# Altium schematic sheet [3]-MCU.SchDoc
size A4
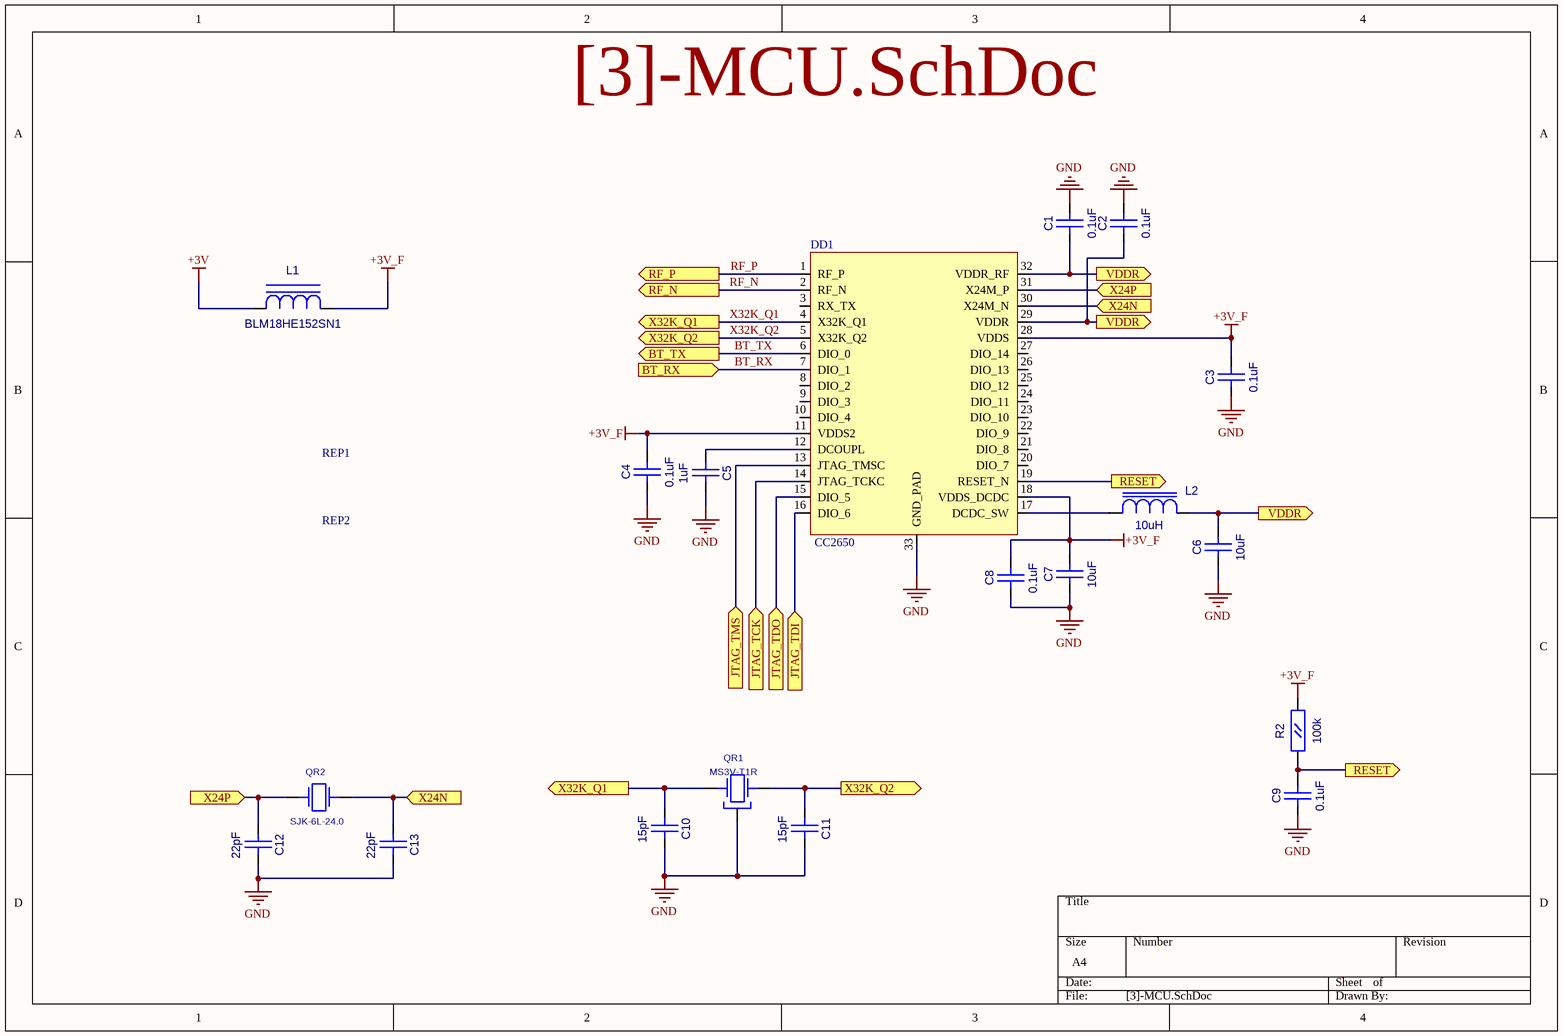
[diagram p0: [3]-MCU.SchDoc]

## Parts
C1  0.1uF  [CC0603]
C2  0.1uF  [CC0603]
C3  0.1uF  [CC0603]
C4  0.1uF  [CC0603]
C5  1uF  [CC0603]
C6  10uF  [CC0805]
C7  10uF  [CC0805]
C8  0.1uF  [CC0603]
C9  0.1uF  [CC0603]
C10  15pF  [CC0603]
C11  15pF  [CC0603]
C12  22pF  [CC0603]
C13  22pF  [CC0603]
DD1  CC2650  [QFN32_TI]
L1  BLM18HE152SN1  [L0603]
L2  10uH  [RC0805]
QR1  MS3V-T1R  [MS3V-T1R]
QR2  SJK-6L-24.0  [AC5032_2]
R2  100k  [RC0603]
REP1  REPER_POINT_1.2  [REPER1.2]  (value not drawn)
REP2  REPER_POINT_1.2  [REPER1.2]  (value not drawn)

## Ports
BT_RX (in), BT_TX (out), JTAG_TCK (in), JTAG_TDI (in), JTAG_TDO (in), JTAG_TMS (in), RESET (out), RF_N (out), RF_P (out), VDDR (out), X24N (in), X24P (in), X32K_Q1 (out), X32K_Q2 (out)

## Nets
+3V: L1.1(A)
+3V_F: C3.2(B) C4.2(B) C7.2(B) C8.2(B) DD1.11(VDDS2) DD1.18(VDDS_DCDC) DD1.28(VDDS) L1.2(C) R2.2(B)
GND: C1.2(B) C2.2(B) C3.1(A) C4.1(A) C5.2(B) C6.1(A) C7.1(A) C8.1(A) C9.1(A) C10.2(B) C11.2(B) C12.2(B) C13.2(B) DD1.33(GND_PAD) QR1.3
BT_RX: DD1.7(DIO_1) ; port BT_RX
BT_TX: DD1.6(DIO_0) ; port BT_TX
JTAG_TCK: DD1.14(JTAG_TCKC) ; port JTAG_TCK
JTAG_TDI: DD1.16(DIO_6) ; port JTAG_TDI
JTAG_TDO: DD1.15(DIO_5) ; port JTAG_TDO
JTAG_TMS: DD1.13(JTAG_TMSC) ; port JTAG_TMS
RESET: C9.2(B) DD1.19(RESET_N) R2.1(A) ; port RESET
RF_N: DD1.2(RF_N) ; port RF_N
RF_P: DD1.1(RF_P) ; port RF_P
VDDR: C1.1(A) C2.1(A) C6.2(B) DD1.29(VDDR) DD1.32(VDDR_RF) L2.2(B) ; port VDDR
X24N: C13.1(A) DD1.30(X24M_N) QR2.2 ; port X24N
X24P: C12.1(A) DD1.31(X24M_P) QR2.1 ; port X24P
X32K_Q1: C10.1(A) DD1.4(X32K_Q1) QR1.2(X2) ; port X32K_Q1
X32K_Q2: C11.1(A) DD1.5(X32K_Q2) QR1.1(X1) ; port X32K_Q2
NetC5_1: C5.1(A) DD1.12(DCOUPL)
NetDD1_17: DD1.17(DCDC_SW) L2.1(A)

Not connected (* = marked no-connect by the designer): DD1 3(RX_TX) 8(DIO_2) 9(DIO_3) 10(DIO_4) 20(DIO_7) 21(DIO_8) 22(DIO_9) 23(DIO_10) 24(DIO_11) 25(DIO_12) 26(DIO_13) 27(DIO_14); REP1 1; REP2 1

## Library data of the parts
C1-C5 C8-C13 = CC0603
  C1-C4 C8 C9: Value: 0.1uF
  C5: Value: 1uF
  C10 C11: Value: 15pF
  C12 C13: Value: 22pF
C6 C7 = CC0805: Value: 10uF
DD1 = CC2650RHB: CC2650RHBT; Value: CC2650
L1 = L0603: Value: BLM18HE152SN1
L2 = L0805: Value: 10uH
QR1 = MS3V-T1R: CRYSTAL_32768 Hz; Value: *
QR2 = AC5032_2: AC5032/2; Value: SJK-6L-24.0
R2 = RC0603: Value: 100k
REP1 REP2 = REPER1.2: Value: REPER_POINT_1.2